# Altium project IndicationBoard.PrjPcb
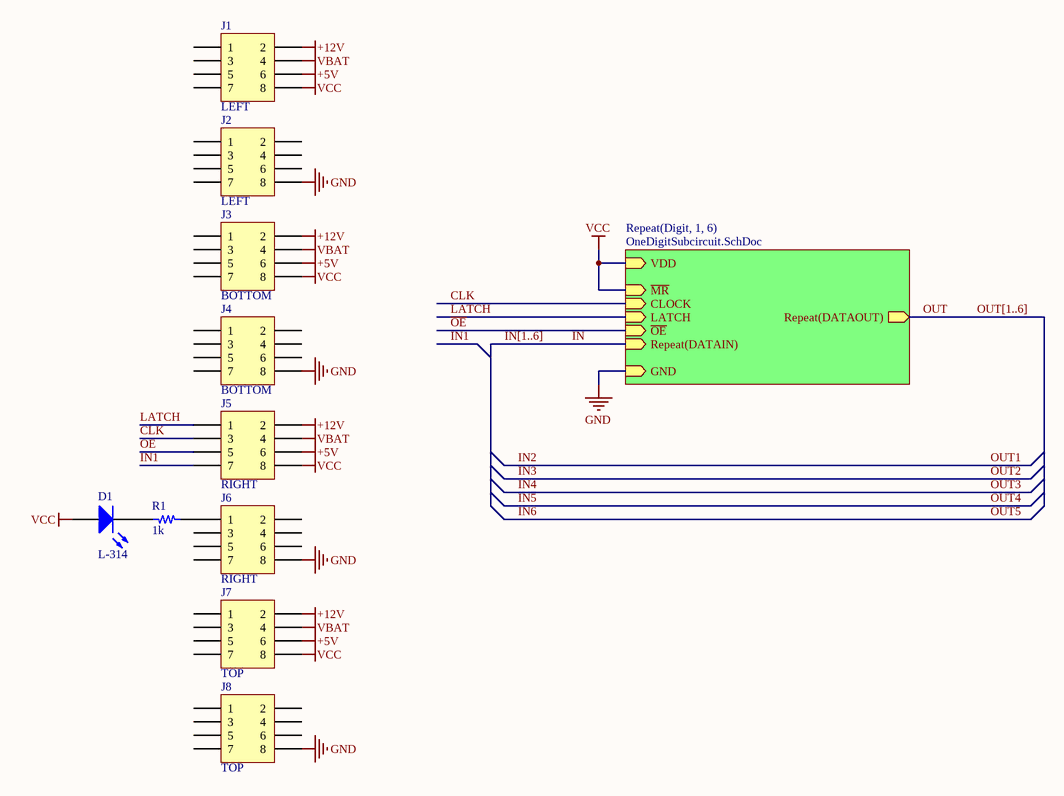
[diagram p0: IndicationBoard.SchDoc]
2 sheets, 76 parts. Net scope: hierarchical (ports join the sheet entries above them; power ports are global).
Board file: IndicationBoard.PcbDoc
Sheets:
  IndicationBoard.SchDoc
    Digit1 = OneDigitSubcircuit.SchDoc
    Digit2 = OneDigitSubcircuit.SchDoc
    Digit3 = OneDigitSubcircuit.SchDoc
    Digit4 = OneDigitSubcircuit.SchDoc
    Digit5 = OneDigitSubcircuit.SchDoc
    Digit6 = OneDigitSubcircuit.SchDoc

## Sheet IndicationBoard.SchDoc
size A4

### Parts
D1  L-314  [LED 3mm]
J1  LEFT  [PBDM-8]
J2  LEFT  [PBDM-8]
J3  BOTTOM  [PBDM-8]
J4  BOTTOM  [PBDM-8]
J5  RIGHT  [PBDM-8]
J6  RIGHT  [PBDM-8]
J7  TOP  [PBDM-8]
J8  TOP  [PBDM-8]
R1  1k  [RES0402]

### Sub-sheets
Repeat(Digit, 1, 6) = OneDigitSubcircuit.SchDoc: VDD (in), GND (in), ~{MR} (in), ~{OE} (in), CLOCK (in), LATCH (in), Repeat(DATAIN) (in), Repeat(DATAOUT) (out)

### Nets
+5V: J1.6 J3.6 J5.6 J7.6
+12V: J1.2 J3.2 J5.2 J7.2
GND: J2.8 J4.8 J6.8 J8.8 ; sheet Repeat(Digit, 1, 6)/GND
VBAT: J1.4 J3.4 J5.4 J7.4
VCC: D1.2 J1.8 J3.8 J5.8 J7.8 ; sheet Repeat(Digit, 1, 6)/VDD, sheet Repeat(Digit, 1, 6)/~{MR}  [project net +VDD]
CLK: J5.3 ; sheet Repeat(Digit, 1, 6)/CLOCK
IN: sheet Repeat(Digit, 1, 6)/Repeat(DATAIN)
IN1: J5.7
LATCH: J5.1 ; sheet Repeat(Digit, 1, 6)/LATCH
~{OE}: J5.5 ; sheet Repeat(Digit, 1, 6)/~{OE}
OUT: sheet Repeat(Digit, 1, 6)/Repeat(DATAOUT)
NetD1_1: D1.1 R1.1
NetJ6_1: J6.1 R1.2

Not connected (* = marked no-connect by the designer): J1 1 3 5 7; J2 1 2 3 4 5 6 7; J3 1 3 5 7; J4 1 2 3 4 5 6 7; J6 2 3 4 5 6 7; J7 1 3 5 7; J8 1 2 3 4 5 6 7

### Buses and harness runs
bus IN[1..6]
bus OUT[1..6]

### Library data of the parts
D1 = L-314: 3-mm LED; PartNumber: L-314; Category: Optical; ComponentLink1Description: Datasheet; ComponentLink1URL: d:\_AltiumLibs\Pdf\Optical\L-3xx (Paralight).pdf#page=2; Author: oiezhov
J1-J8 = PBDM-8: 2x4-pin header, pitch 2.54 mm; PartNumber: PBDM-8; Category: Connector; ComponentLink1Description: Datasheet; ComponentLink1URL: d:\_AltiumLibs\Pdf\Mechanical\Connector\pbsm.pdf; Author: oiezhov
R1 = RES0402: Ceramic chip resistor; PartNumber: RES0402; Value: 1k; Category: Resistor; Author: oiezhov

## Sheet OneDigitSubcircuit.SchDoc
size A4
Used 6 times, as channels Digit1, Digit2, Digit3, Digit4, Digit5, Digit6. Parts and nets are listed once, with the designators drawn on the sheet.
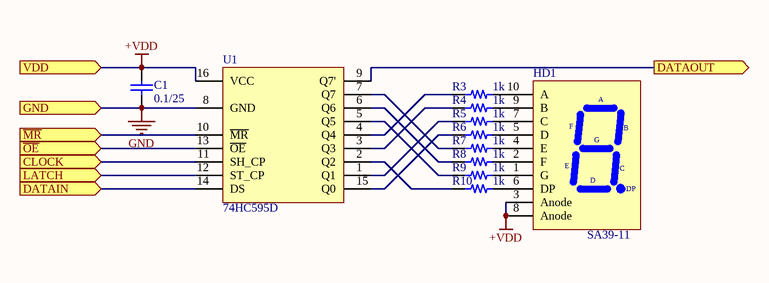
[diagram p1: OneDigitSubcircuit.SchDoc]

### Parts
C1  0.1/25  [CAP0603]
HD1  SA39-11  [39-11 7-segment]
R3  1k  [RES0402]
R4  1k  [RES0402]
R5  1k  [RES0402]
R6  1k  [RES0402]
R7  1k  [RES0402]
R8  1k  [RES0402]
R9  1k  [RES0402]
R10  1k  [RES0402]
U1  74HC595D  [SO16]

### Ports
CLOCK (in), DATAIN (in), DATAOUT (out), GND (in), LATCH (in), VDD (in), ~{MR} (in), ~{OE} (in)

### Nets
+VDD: C1.2 HD1.3(Anode) HD1.8(Anode) U1.16(VCC) ; port VDD
GND: C1.1 U1.8(GND) ; port GND
CLOCK: U1.11(SH_CP) ; port CLOCK
DATAIN: U1.14(DS) ; port DATAIN
DATAOUT: U1.9(Q7') ; port DATAOUT
LATCH: U1.12(ST_CP) ; port LATCH
~{MR}: U1.10(~{MR}) ; port ~{MR}
~{OE}: U1.13(~{OE}) ; port ~{OE}
NetHD1_1: HD1.1(G) R9.1
NetHD1_2: HD1.2(F) R8.1
NetHD1_4: HD1.4(E) R7.1
NetHD1_5: HD1.5(D) R6.1
NetHD1_6: HD1.6(DP) R10.1
NetHD1_7: HD1.7(C) R5.1
NetHD1_9: HD1.9(B) R4.1
NetHD1_10: HD1.10(A) R3.1
NetR3_2: R3.2 U1.4(Q4)
NetR4_2: R4.2 U1.3(Q3)
NetR5_2: R5.2 U1.1(Q1)
NetR6_2: R6.2 U1.15(Q0)
NetR7_2: R7.2 U1.7(Q7)
NetR8_2: R8.2 U1.6(Q6)
NetR9_2: R9.2 U1.5(Q5)
NetR10_2: R10.2 U1.2(Q2)

### Channels
Digit1: designators end in _Digit1; ports CLOCK=CLK DATAIN=IN1 DATAOUT=IN2 GND=GND LATCH=LATCH VDD=+VDD ~{MR}=+VDD ~{OE}=~{OE}
Digit2: designators end in _Digit2; ports CLOCK=CLK DATAIN=IN2 DATAOUT=IN3 GND=GND LATCH=LATCH VDD=+VDD ~{MR}=+VDD ~{OE}=~{OE}
Digit3: designators end in _Digit3; ports CLOCK=CLK DATAIN=IN3 DATAOUT=IN4 GND=GND LATCH=LATCH VDD=+VDD ~{MR}=+VDD ~{OE}=~{OE}
Digit4: designators end in _Digit4; ports CLOCK=CLK DATAIN=IN4 DATAOUT=IN5 GND=GND LATCH=LATCH VDD=+VDD ~{MR}=+VDD ~{OE}=~{OE}
Digit5: designators end in _Digit5; ports CLOCK=CLK DATAIN=IN5 DATAOUT=IN6 GND=GND LATCH=LATCH VDD=+VDD ~{MR}=+VDD ~{OE}=~{OE}
Digit6: designators end in _Digit6; ports CLOCK=CLK DATAIN=IN6 DATAOUT=OUT6 GND=GND LATCH=LATCH VDD=+VDD ~{MR}=+VDD ~{OE}=~{OE}

### Library data of the parts
C1 = CAP0603: Ceramic chip capacitor 0603; Value: 0.1; Voltage: 25; PartNumber: CAP0603; Category: Capacitor; Author: oiezhov
HD1 = SA39-11: 9.9mm (0.39INCH) Single Digit 7-Segment Numeric Display (Common Anode); PartNumber: SA39-11; Category: Optical; ComponentLink1Description: Datasheet; ComponentLink1URL: d:\_AltiumLibs\Pdf\Optical\SA39-11CGKWA.pdf; Author: oiezhov
R3-R10 = RES0402: Ceramic chip resistor; PartNumber: RES0402; Value: 1k; Category: Resistor; Author: oiezhov
U1 = 74HC595D: 8-bit serial-in, serial or parallel-out shift register with output latches; 3-state; PartNumber: 74HC595D; Category: IC/Logic; ComponentLink1Description: Datasheet; ComponentLink1URL: d:\_AltiumLibs\Pdf\IC\Logic\74HC_HCT595.pdf; Author: oiezhov

## Nets that join several sheets
+VDD: IndicationBoard (5 pins), Digit1 (5 pins), Digit2 (5 pins), Digit3 (5 pins), Digit4 (5 pins), Digit5 (5 pins), Digit6 (5 pins)
GND: IndicationBoard (J2.8 J4.8 J6.8 J8.8), Digit1 (C1_Digit1.1 U1_Digit1.8), Digit2 (C1_Digit2.1 U1_Digit2.8), Digit3 (C1_Digit3.1 U1_Digit3.8), Digit4 (C1_Digit4.1 U1_Digit4.8), Digit5 (C1_Digit5.1 U1_Digit5.8), Digit6 (C1_Digit6.1 U1_Digit6.8)
CLK: IndicationBoard (J5.3), Digit1 (U1_Digit1.11), Digit2 (U1_Digit2.11), Digit3 (U1_Digit3.11), Digit4 (U1_Digit4.11), Digit5 (U1_Digit5.11), Digit6 (U1_Digit6.11)
IN1: IndicationBoard (J5.7), Digit1 (U1_Digit1.14)
IN2: Digit1 (U1_Digit1.9), Digit2 (U1_Digit2.14)
IN3: Digit2 (U1_Digit2.9), Digit3 (U1_Digit3.14)
IN4: Digit3 (U1_Digit3.9), Digit4 (U1_Digit4.14)
IN5: Digit4 (U1_Digit4.9), Digit5 (U1_Digit5.14)
IN6: Digit5 (U1_Digit5.9), Digit6 (U1_Digit6.14)
LATCH: IndicationBoard (J5.1), Digit1 (U1_Digit1.12), Digit2 (U1_Digit2.12), Digit3 (U1_Digit3.12), Digit4 (U1_Digit4.12), Digit5 (U1_Digit5.12), Digit6 (U1_Digit6.12)
~{OE}: IndicationBoard (J5.5), Digit1 (U1_Digit1.13), Digit2 (U1_Digit2.13), Digit3 (U1_Digit3.13), Digit4 (U1_Digit4.13), Digit5 (U1_Digit5.13), Digit6 (U1_Digit6.13)